# Altium schematic sheet sla2216-conn-coax.SchDoc
size A4; DocumentNumber: 5; SheetNumber: 5; SheetTotal: 6
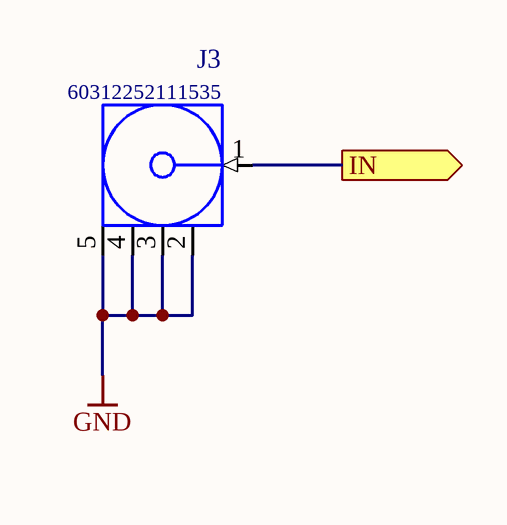
[diagram p0: sla2216-conn-coax.SchDoc]

## Parts
J3  60312252111535  [60312252111535]

## Ports
IN (out)

## Nets
GND: J3.2(GND) J3.3(GND) J3.4(GND) J3.5(GND)
IN: J3.1(Signal) ; port IN

## Library data of the parts
J3 = 60312252111535: WR-SMA Connector, PCB End Launch Jack, IP67, DC~6GHz, 50Ohm; Manufacturer: Wurth Elektronik; Connector Type: SMA; Orientation Type: Straight; Interface: MIL-STD-348; Center Contact Diameter: 0.51 WIDE x 0.25 THK; ComponentLink1Description: Manufacturer; ComponentLink1URL: http://www.we-online.de; ComponentLink2Description: Datasheet; ComponentLink2URL: https://www.we-online.com/catalog/datasheet/60312252111535.pdf; Manufacturer Part Number: 60312252111535; Published Date: November 2021; Operating Temperature: -65 to +165degC; Gender: Jack; Impedance: 50Ohm; Packaging: Tray; Frequency Range: DC~6GHz; Mounting Technology: End Launch